# Altium schematic sheet LC_OUTPUTS.SchDoc
size A
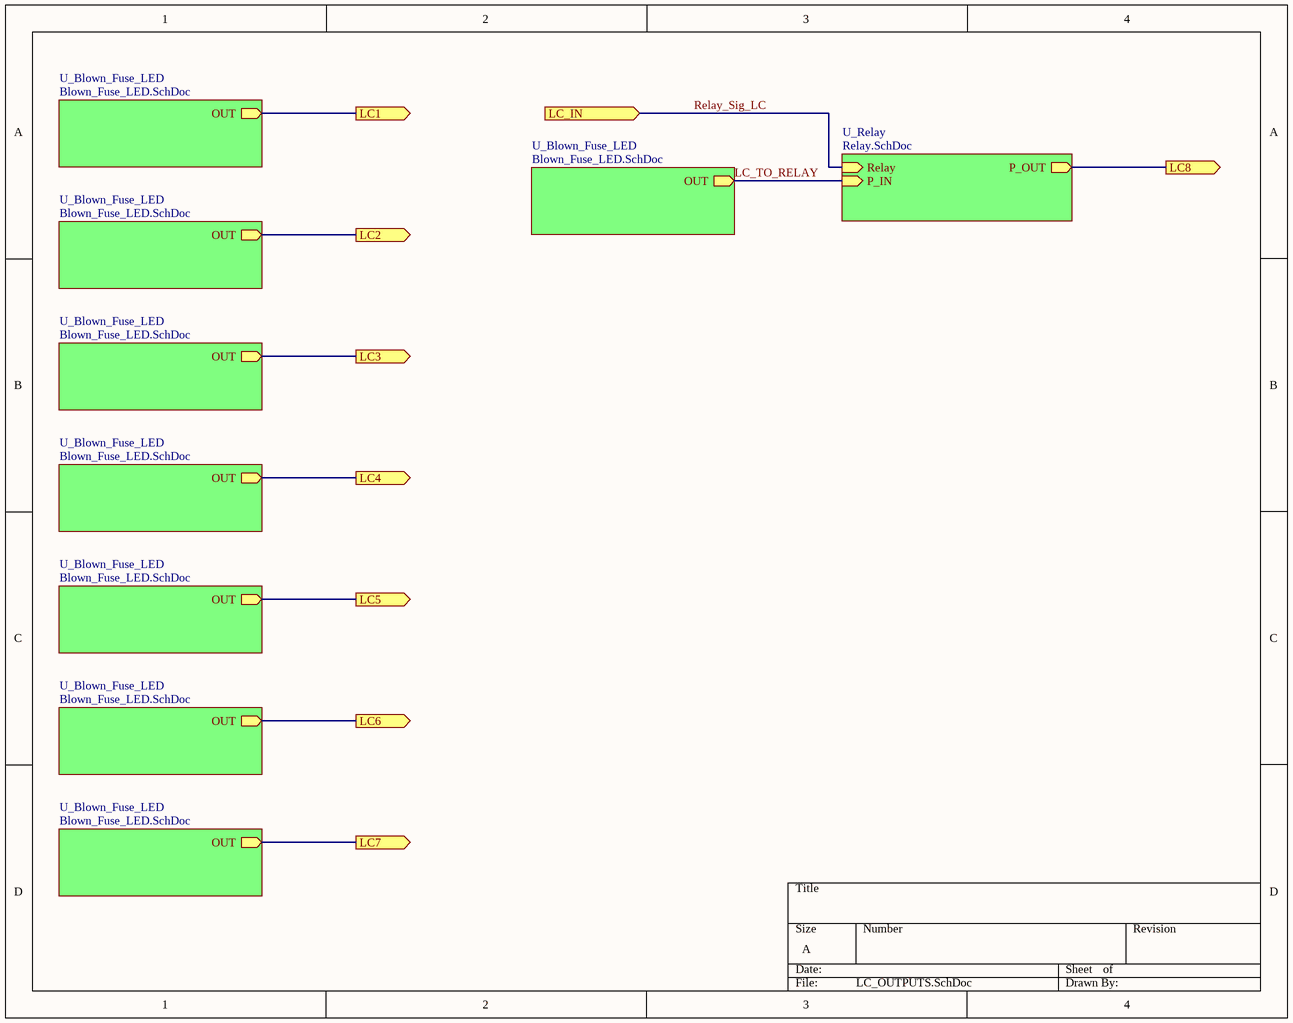
[diagram p0: LC_OUTPUTS.SchDoc]

## Sub-sheets
U_Blown_Fuse_LED = Blown_Fuse_LED.SchDoc: OUT (out)
U_Blown_Fuse_LED = Blown_Fuse_LED.SchDoc: OUT (out)
U_Blown_Fuse_LED = Blown_Fuse_LED.SchDoc: OUT (out)
U_Blown_Fuse_LED = Blown_Fuse_LED.SchDoc: OUT (out)
U_Blown_Fuse_LED = Blown_Fuse_LED.SchDoc: OUT (out)
U_Blown_Fuse_LED = Blown_Fuse_LED.SchDoc: OUT (out)
U_Blown_Fuse_LED = Blown_Fuse_LED.SchDoc: OUT (out)
U_Blown_Fuse_LED = Blown_Fuse_LED.SchDoc: OUT (out)
U_Relay = Relay.SchDoc: Relay (in), P_OUT (out), P_IN (in)

## Ports
LC1 (out), LC2 (out), LC3 (out), LC4 (out), LC5 (out), LC6 (out), LC7 (out), LC8 (out), LC_IN (in)

## Nets
LC1: port LC1, sheet U_Blown_Fuse_LED/OUT
LC2: port LC2, sheet U_Blown_Fuse_LED/OUT
LC3: port LC3, sheet U_Blown_Fuse_LED/OUT
LC4: port LC4, sheet U_Blown_Fuse_LED/OUT
LC5: port LC5, sheet U_Blown_Fuse_LED/OUT
LC6: port LC6, sheet U_Blown_Fuse_LED/OUT
LC7: port LC7, sheet U_Blown_Fuse_LED/OUT
LC8: port LC8, sheet U_Relay/P_OUT
LC_TO_RELAY: sheet U_Blown_Fuse_LED/OUT, sheet U_Relay/P_IN
Relay_Sig_LC: port LC_IN, sheet U_Relay/Relay